# Altium project HAND_2.PrjPCB
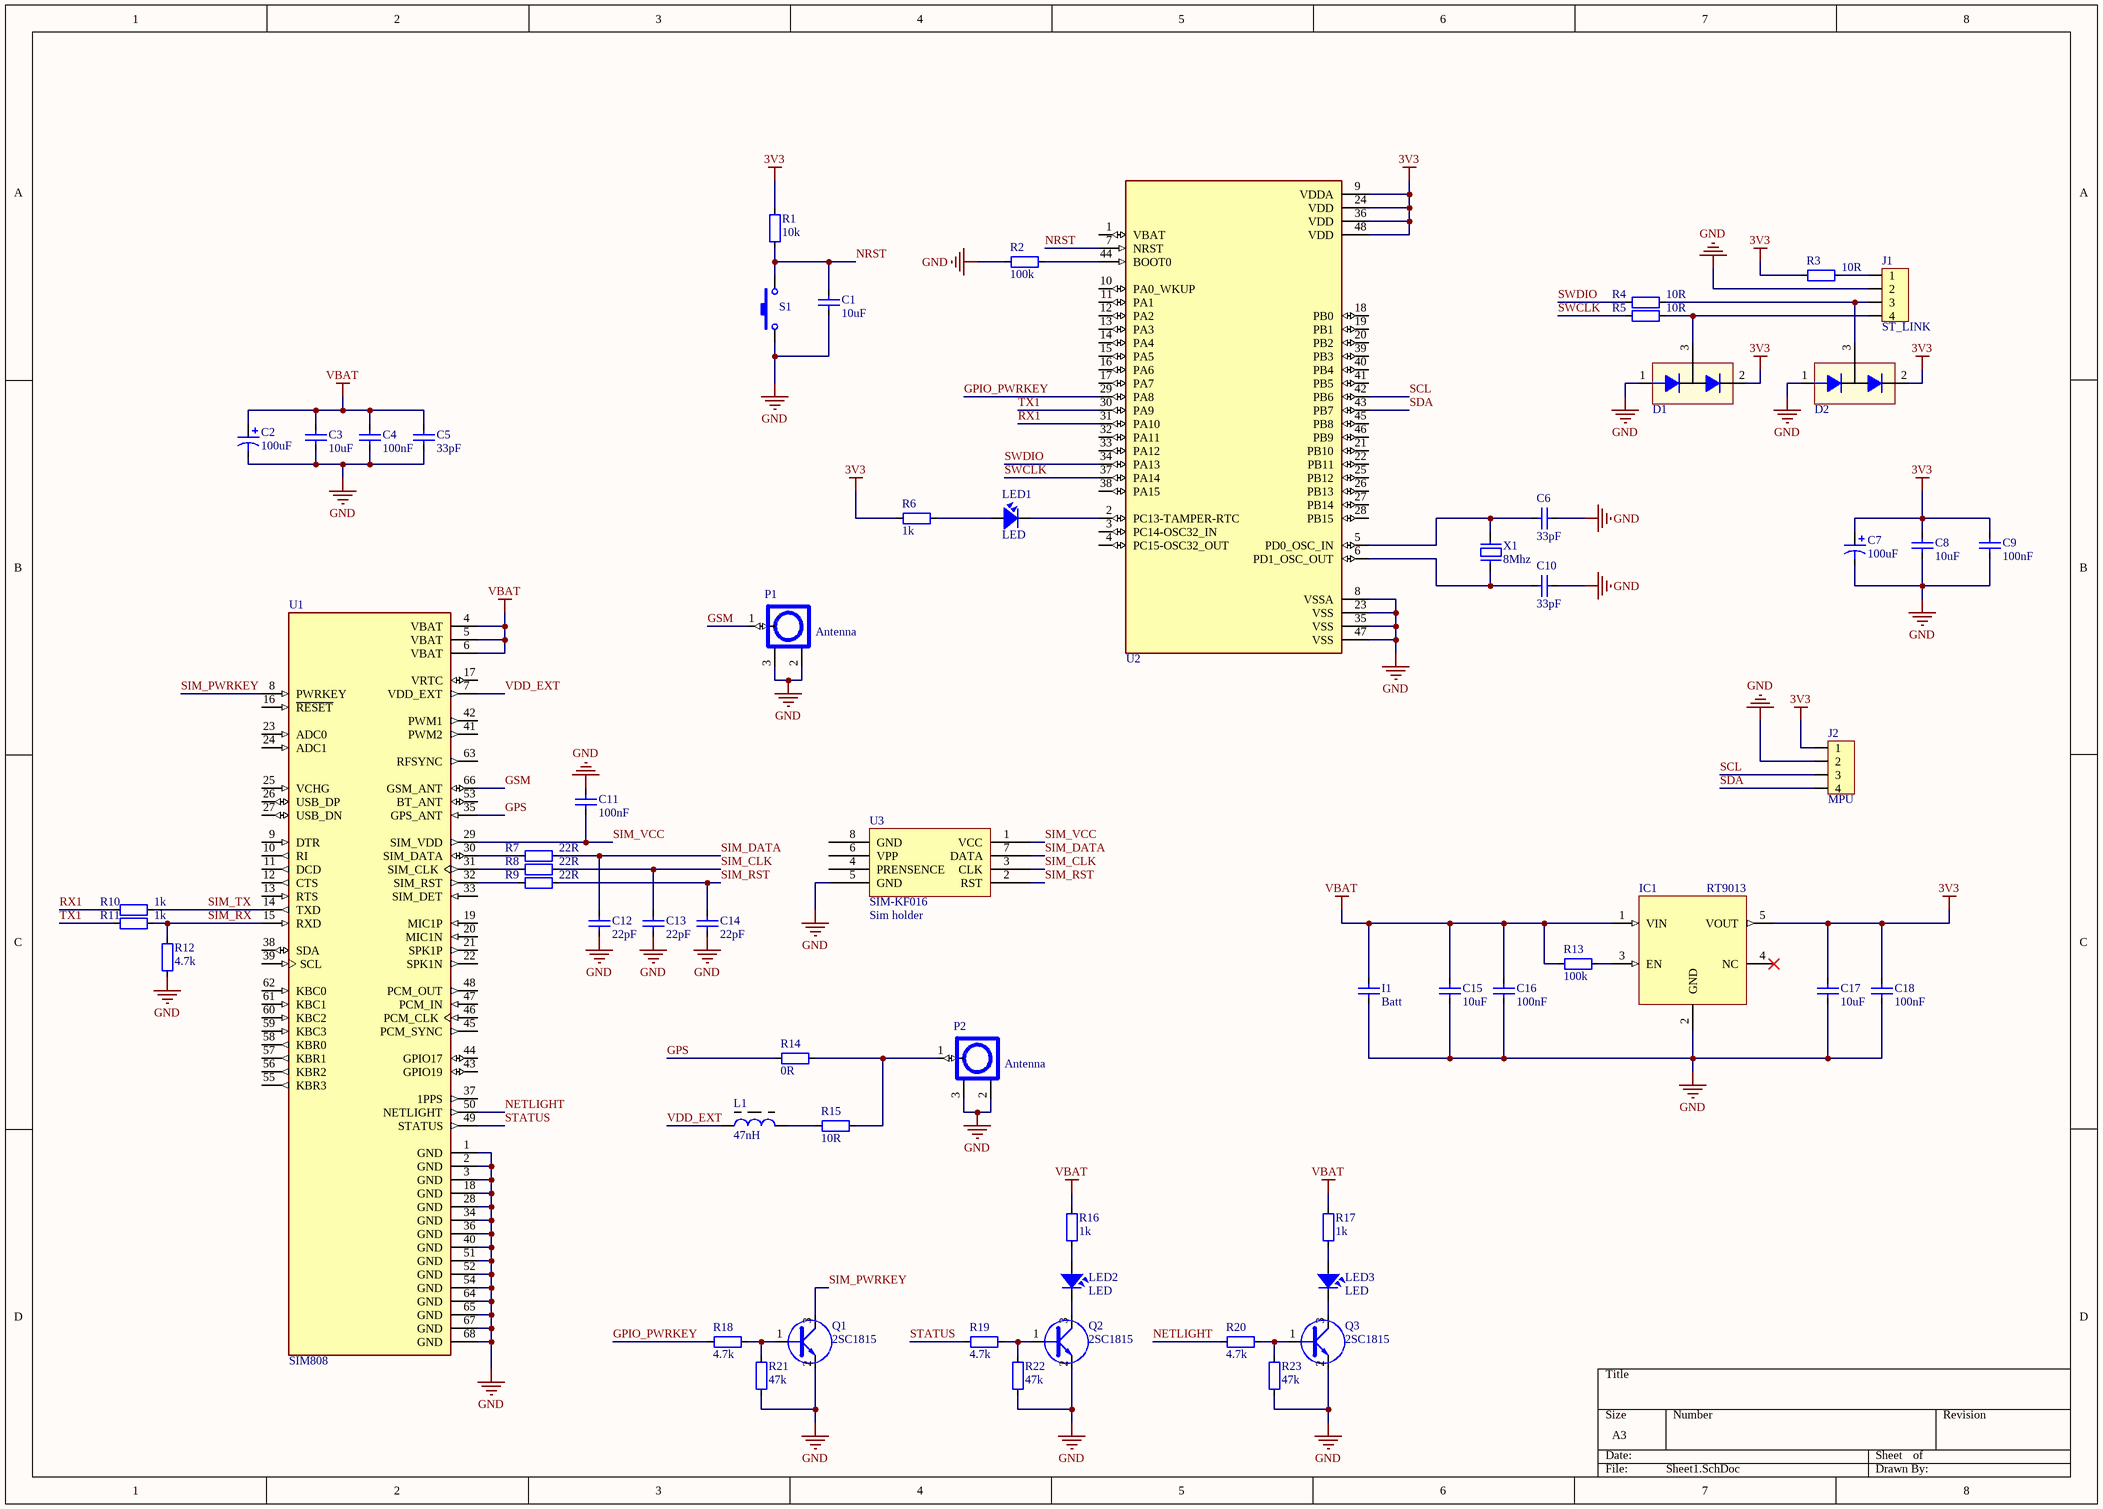
[diagram p0: Sheet1.SchDoc]
1 sheet, 61 parts. Net scope: global (net labels, ports and power ports of the same name join across sheets).
Board file: PCB.PcbDoc

## Sheet Sheet1.SchDoc
size A3

### Parts
C1  10uF  [CAP_0603]
C2  100uF  [CAP_7343]
C3  10uF  [CAP_0603]
C4  100nF  [CAP_0603]
C5  33pF  [CAP_0603]
C6  33pF  [CAP_0603]
C7  100uF  [CAP_7343]
C8  10uF  [CAP_0603]
C9  100nF  [CAP_0603]
C10  33pF  [CAP_0603]
C11  100nF  [CAP_0603]
C12  22pF  [CAP_0603]
C13  22pF  [CAP_0603]
C14  22pF  [CAP_0603]
C15  10uF  [CAP_0603]
C16  100nF  [CAP_0603]
C17  10uF  [CAP_0603]
C18  100nF  [CAP_0603]
D1  DIODE-BAV99  [SOT23]  (value not drawn)
D2  DIODE-BAV99  [SOT23]  (value not drawn)
I1  Batt  [CAP_3216]
IC1  RT9013  [SOT23-5]
J1  ST_LINK  [JP4-D1T]
J2  MPU  [JP4-D1T]
L1  47nH  [L-0805]
LED1  LED  [LED-0805-Orange]
LED2  LED  [LED-0805-Yellow]
LED3  LED  [LED-0805-Red]
P1  Antenna  [IPXS]
P2  Antenna  [IPXS]
Q1  2SC1815  [SOT23D]
Q2  2SC1815  [SOT23D]
Q3  2SC1815  [SOT23D]
R1  10k  [RES-SMD-0603]
R2  100k  [RES-SMD-0603]
R3  10R  [RES-SMD-0603]
R4  10R  [RES-SMD-0603]
R5  10R  [RES-SMD-0603]
R6  1k  [RES-SMD-0603]
R7  22R  [RES-SMD-0603]
R8  22R  [RES-SMD-0603]
R9  22R  [RES-SMD-0603]
R10  1k  [RES-SMD-0603]
R11  1k  [RES-SMD-0603]
R12  4.7k  [RES-SMD-0603]
R13  100k  [RES-SMD-0603]
R14  0R  [RES-SMD-0805]
R15  10R  [RES-SMD-0805]
R16  1k  [RES-SMD-0603]
R17  1k  [RES-SMD-0603]
R18  4.7k  [RES-SMD-0603]
R19  4.7k  [RES-SMD-0603]
R20  4.7k  [RES-SMD-0603]
R21  47k  [RES-SMD-0603]
R22  47k  [RES-SMD-0603]
R23  47k  [RES-SMD-0603]
S1  SW-SMD  [SW 3x2x4]  (value not drawn)
U1  SIM808  [XCVR_SIM808]
U2  STM32  [LQFP 48]  (value not drawn)
U3  SIM-KF016  value Sim holder  [Sim Socket]
X1  8Mhz  [XTAL 5032 SMD]

### Nets
3V3: C7.1 C8.2 C9.2 C17.2 C18.2 D1.2 D2.2 IC1.5(VOUT) J2.1 R1.2 R3.1 R6.1 U2.9(VDDA) U2.24(VDD) U2.36(VDD) U2.48(VDD)
GND: C1.1 C2.2 C3.1 C4.1 C5.1 C6.2 C7.2 C8.1 C9.1 C10.2 C11.1 C12.2 C13.2 C14.2 C15.1 C16.1 C17.1 C18.1 D1.1 D2.1 I1.1 IC1.2(GND) J1.2 J2.2 P1.2 P1.3 P2.2 P2.3 Q1.2(E) Q2.2(E) Q3.2(E) R2.2 R12.2 R21.1 R22.1 R23.1 S1.1 U1.1(GND) U1.2(GND) U1.3(GND) U1.18(GND) U1.28(GND) U1.34(GND) U1.36(GND) U1.40(GND) U1.51(GND) U1.52(GND) U1.54(GND) U1.64(GND) U1.65(GND) U1.67(GND) U1.68(GND) U2.8(VSSA) U2.23(VSS) U2.35(VSS) U2.47(VSS) U3.5(GND)
VBAT: C2.1 C3.2 C4.2 C5.2 C15.2 C16.2 I1.2 IC1.1(VIN) R13.2 R16.2 R17.2 U1.4(VBAT) U1.5(VBAT) U1.6(VBAT)
GPIO_PWRKEY: R18.1 U2.29(PA8)
GPS: R14.1 U1.35(GPS_ANT)
GSM: P1.1 U1.66(GSM_ANT)
NETLIGHT: R20.1 U1.50(NETLIGHT)
NRST: C1.2 R1.1 S1.2 U2.7(NRST)
RX1: R10.2 U2.31(PA10)
SCL: J2.3 U2.42(PB6)
SDA: J2.4 U2.43(PB7)
SIM_CLK: C13.1 R8.1 U3.3(CLK)
SIM_DATA: C12.1 R7.1 U3.7(DATA)
SIM_PWRKEY: Q1.3(C) U1.8(PWRKEY)
SIM_RST: C14.1 R9.1 U3.2(RST)
SIM_RX: R11.1 R12.1 U1.15(RXD)
SIM_TX: R10.1 U1.14(TXD)
SIM_VCC: C11.2 U1.29(SIM_VDD) U3.1(VCC)
STATUS: R19.1 U1.49(STATUS)
SWCLK: R5.1 U2.37(PA14)
SWDIO: R4.1 U2.34(PA13)
TX1: R11.2 U2.30(PA9)
VDD_EXT: L1.1 U1.7(VDD_EXT)
NetC6_1: C6.1 U2.5(PD0_OSC_IN) X1.2
NetC10_1: C10.1 U2.6(PD1_OSC_OUT) X1.1
NetD1_3: D1.3 J1.4 R5.2
NetD2_3: D2.3 J1.3 R4.2
NetIC1_3: IC1.3(EN) R13.1
NetJ1_1: J1.1 R3.2
NetL1_2: L1.2 R15.2
NetLED1_1: LED1.1 R6.2
NetLED1_2: LED1.2 U2.2(PC13-TAMPER-RTC)
NetLED2_1: LED2.1 R16.1
NetLED2_2: LED2.2 Q2.3(C)
NetLED3_1: LED3.1 R17.1
NetLED3_2: LED3.2 Q3.3(C)
NetP2_1: P2.1 R14.2 R15.1
NetQ1_1: Q1.1(B) R18.2 R21.2
NetQ2_1: Q2.1(B) R19.2 R22.2
NetQ3_1: Q3.1(B) R20.2 R23.2
NetR2_1: R2.1 U2.44(BOOT0)
NetR7_2: R7.2 U1.30(SIM_DATA)
NetR8_2: R8.2 U1.31(SIM_CLK)
NetR9_2: R9.2 U1.32(SIM_RST)

Not connected (* = marked no-connect by the designer): IC1 4(NC)*; U1 9(DTR) 10(RI) 11(DCD) 12(CTS) 13(RTS) 16(~{RESET}) 17(VRTC) 19(MIC1P) 20(MIC1N) 21(SPK1P) 22(SPK1N) 23(ADC0) 24(ADC1) 25(VCHG) 26(USB_DP) 27(USB_DN) 33(SIM_DET) 37(1PPS) 38(SDA) 39(SCL) 41(PWM2) 42(PWM1) 43(GPIO19) 44(GPIO17) 45(PCM_SYNC) 46(PCM_CLK) 47(PCM_IN) 48(PCM_OUT) 53(BT_ANT) 55(KBR3) 56(KBR2) 57(KBR1) 58(KBR0) 59(KBC3) 60(KBC2) 61(KBC1) 62(KBC0) 63(RFSYNC); U2 1(VBAT) 3(PC14-OSC32_IN) 4(PC15-OSC32_OUT) 10(PA0_WKUP) 11(PA1) 12(PA2) 13(PA3) 14(PA4) 15(PA5) 16(PA6) 17(PA7) 18(PB0) 19(PB1) 20(PB2) 21(PB10) 22(PB11) 25(PB12) 26(PB13) 27(PB14) 28(PB15) 32(PA11) 33(PA12) 38(PA15) 39(PB3) 40(PB4) 41(PB5) 45(PB8) 46(PB9); U3 4(PRENSENCE) 6(VPP) 8(GND)

### Library data of the parts
C1 C3-C6 C8-C18 = CapSMD: Capacitor; Value: 33p; Published: 8-Jun-2000; LatestRevisionDate: 17-Jul-2002; LatestRevisionNote: Re-released for DXP Platform.; PackageReference: RAD-0.3; Publisher: Altium Limited
C2 C7 = Cap Pol: Tantalum; Published: 8-Jun-2000; LatestRevisionDate: 17-Jul-2002; LatestRevisionNote: Re-released for DXP Platform.; PackageReference: POLAR0.8; Publisher: Altium Limited
D1 D2 = DIODE-BAV99: ZENER, SOT23,; Manufacturer: ON Semiconductor / Fairchild; Manufacturer Part Number: BAV99; .Creator: LeKhaLinh; Other Drawings: Diode Circuit; PCN Design/Specification: Mold Compound 12/Dec/2007; PCN Assembly/Origin: SOT23 Manufacturing Source 31/May2013 / Assembly Site Addition 20/Jul/2015; PCN Packaging: Binary Year Code Marking 15/Jan/2014; Diode Configuration: 1 Pair Series Connection; Diode Type: Standard; Voltage - DC Reverse (Vr) (Max): 70V; Current - Average Rectified (Io) (per Diode): 200mA; Voltage - Forward (Vf) (Max) @ If: 1.25V @ 150mA; Speed: Small Signal =; Reverse Recovery Time (trr): 6ns; Current - Reverse Leakage @ Vr: 2.5µA @ 70V; Online Catalog: Diode Array; Other Names: BAV99FSDKR; .CheckPCB: LeKhaLinh; .CheckSCH: LeKhaLinh; Supplier 1: Digi-Key; Stock 1: 1165; Pricing 1: 1=0.26, 10=0.21, 100=0.1115, 500=0.0734, 1000=0.0499 (USD); Standard Package: 1; Category: Discrete Semiconductor Products; Family: Diodes, Rectifiers - Arrays; Packaging: Digi-Reel®; Mounting Type: Surface Mount; Package / Case: TO-236-3, SC-59, SOT-23-3; Supplier Device Package: SOT-23-3 (TO-236); ComponentLink1URL: https://www.fairchildsemi.com/package-drawings/MA/MA03B.pdf?src-supplier=Digi-Key; ComponentLink1Description: https://www.fairchildsemi.com/package-drawings/MA/MA03B.pdf?src-supplier=Digi-Key; ComponentLink2URL: http://www.farnell.com/datasheets/1822674.pdf?src-supplier=Element14; ComponentLink2Description: http://www.farnell.com/datasheets/1822674.pdf?src-supplier=Element14; ComponentLink3URL: http://www.mouser.com/ds/2/149/BAV99-22788.pdf?src-supplier=Mouser; ComponentLink3Description: http://www.mouser.com/ds/2/149/BAV99-22788.pdf?src-supplier=Mouser; ComponentLink4URL: http://www.fairchildsemi.com/ds/BA/BAV99.pdf?src-supplier=Avnet+Europe; ComponentLink4Description: http://www.fairchildsemi.com/ds/BA/BAV99.pdf?src-supplier=Avnet+Europe; ComponentLink5URL: https://www.verical.com/server-webapp/html/getDatasheet?partID=110217&src-supplier=Verical; ComponentLink5Description: https://www.verical.com/server-webapp/html/getDatasheet?partID=110217&src-supplier=Verical; ComponentLink6URL: http://www.farnell.com/datasheets/2304409.pdf?src-supplier=Element14; ComponentLink6Description: http://www.farnell.com/datasheets/2304409.pdf?src-supplier=Element14; Supplier 2: Mouser; Stock 2: 0; Supplier 3: Arrow; Stock 3: 5700; Pricing 3: 1=0.1933, 10=0.1873, 25=0.1555, 100=0.0806, 250=0.0724, 500=0.0523, 1000=0.0428, 3000=0.0342 (USD); Supplier Part Number 1: BAV99FSCT-ND; Supplier Part Number 2: 512-BAV99; Supplier Part Number 3: BAV99
I1 = CapSMD: Pad; Value: 33p; Published: 8-Jun-2000; LatestRevisionDate: 17-Jul-2002; LatestRevisionNote: Re-released for DXP Platform.; PackageReference: RAD-0.3; Publisher: Altium Limited
IC1 = RT9013: RT9013-33GB IC REG LINEAR 3.3V 500mA SOT23-5
J1 J2 = Header4: Header IDC, 4 x 1 Pin Vertical 2.54mm Pitch (Non-Boxed, Male); Manufacturer: W¨¹rth Elektronik eiSos GmbH; partNo: 613002143121; ComponentLink1 Description: Manufacturer; ComponentLink2 Description: Datasheet; NoPins: 02; Created Date: 29 March 2013; ComponentLink1URL: http://www.we-online.com; ComponentLink2URL: http://katalog.we-online.de/em/datasheet/6130xx143121.pdf; Created by: Karrer Zheng
L1 = Inductor Ferit: Inductor; Value: 150 mH
LED1-LED3 = LED: LED Single colour Green and Red; Value: LED 3 ly Single Colour
P1 P2 = IPXSx66: Antenna GSM GPS
Q1-Q3 = 2SC1815: NPN 600mW, ECB; Value: C1815
R1-R23 = Resistor - SMD: Resistor; Manufacturer: Generic Components; Class: Passive; Published: 08/06/2000; Publisher: Altium Hobart Technology Centre
S1 = SW-SMD: Switch; Published: 24-Mar-1999; LatestRevisionDate: 17-Jul-2002; LatestRevisionNote: Re-released for DXP Platform.; PackageReference: SPST-2; Publisher: Altium Limited
U1 = SIM808: SIM808 GPS, GPRS/GSM RF Arduino Platform Evaluation Expansion Board; MF: Adafruit Industries; MP: SIM808; Package: None; SnapEDA_Link: https://www.snapeda.com/parts/SIM808/SIMcom%20Wireless%20solutions%20Co.%2CLtd/view-part/424834/?ref=snap; Availability: Unavailable; Price: None; Value: *; ComponentLink1Description: https://banlinhkien.com/sim808-p6650749.html; ComponentLink1URL: https://banlinhkien.com/sim808-p6650749.html
U2 = STM32F103C8T6: STM32 ARM-based 32-bit MCU with 64 Kbytes Flash, 64-pin LQFP, Industrial Temperature
U3 = Sim holder: SIM Card Holder KF-016
X1 = XT2: Crystal For all Crystal 2pin.; Value: 4Mhz